# EasyEDA Pro project ProDoc_PCB1_2025-03-25.epro

# Board PCB1
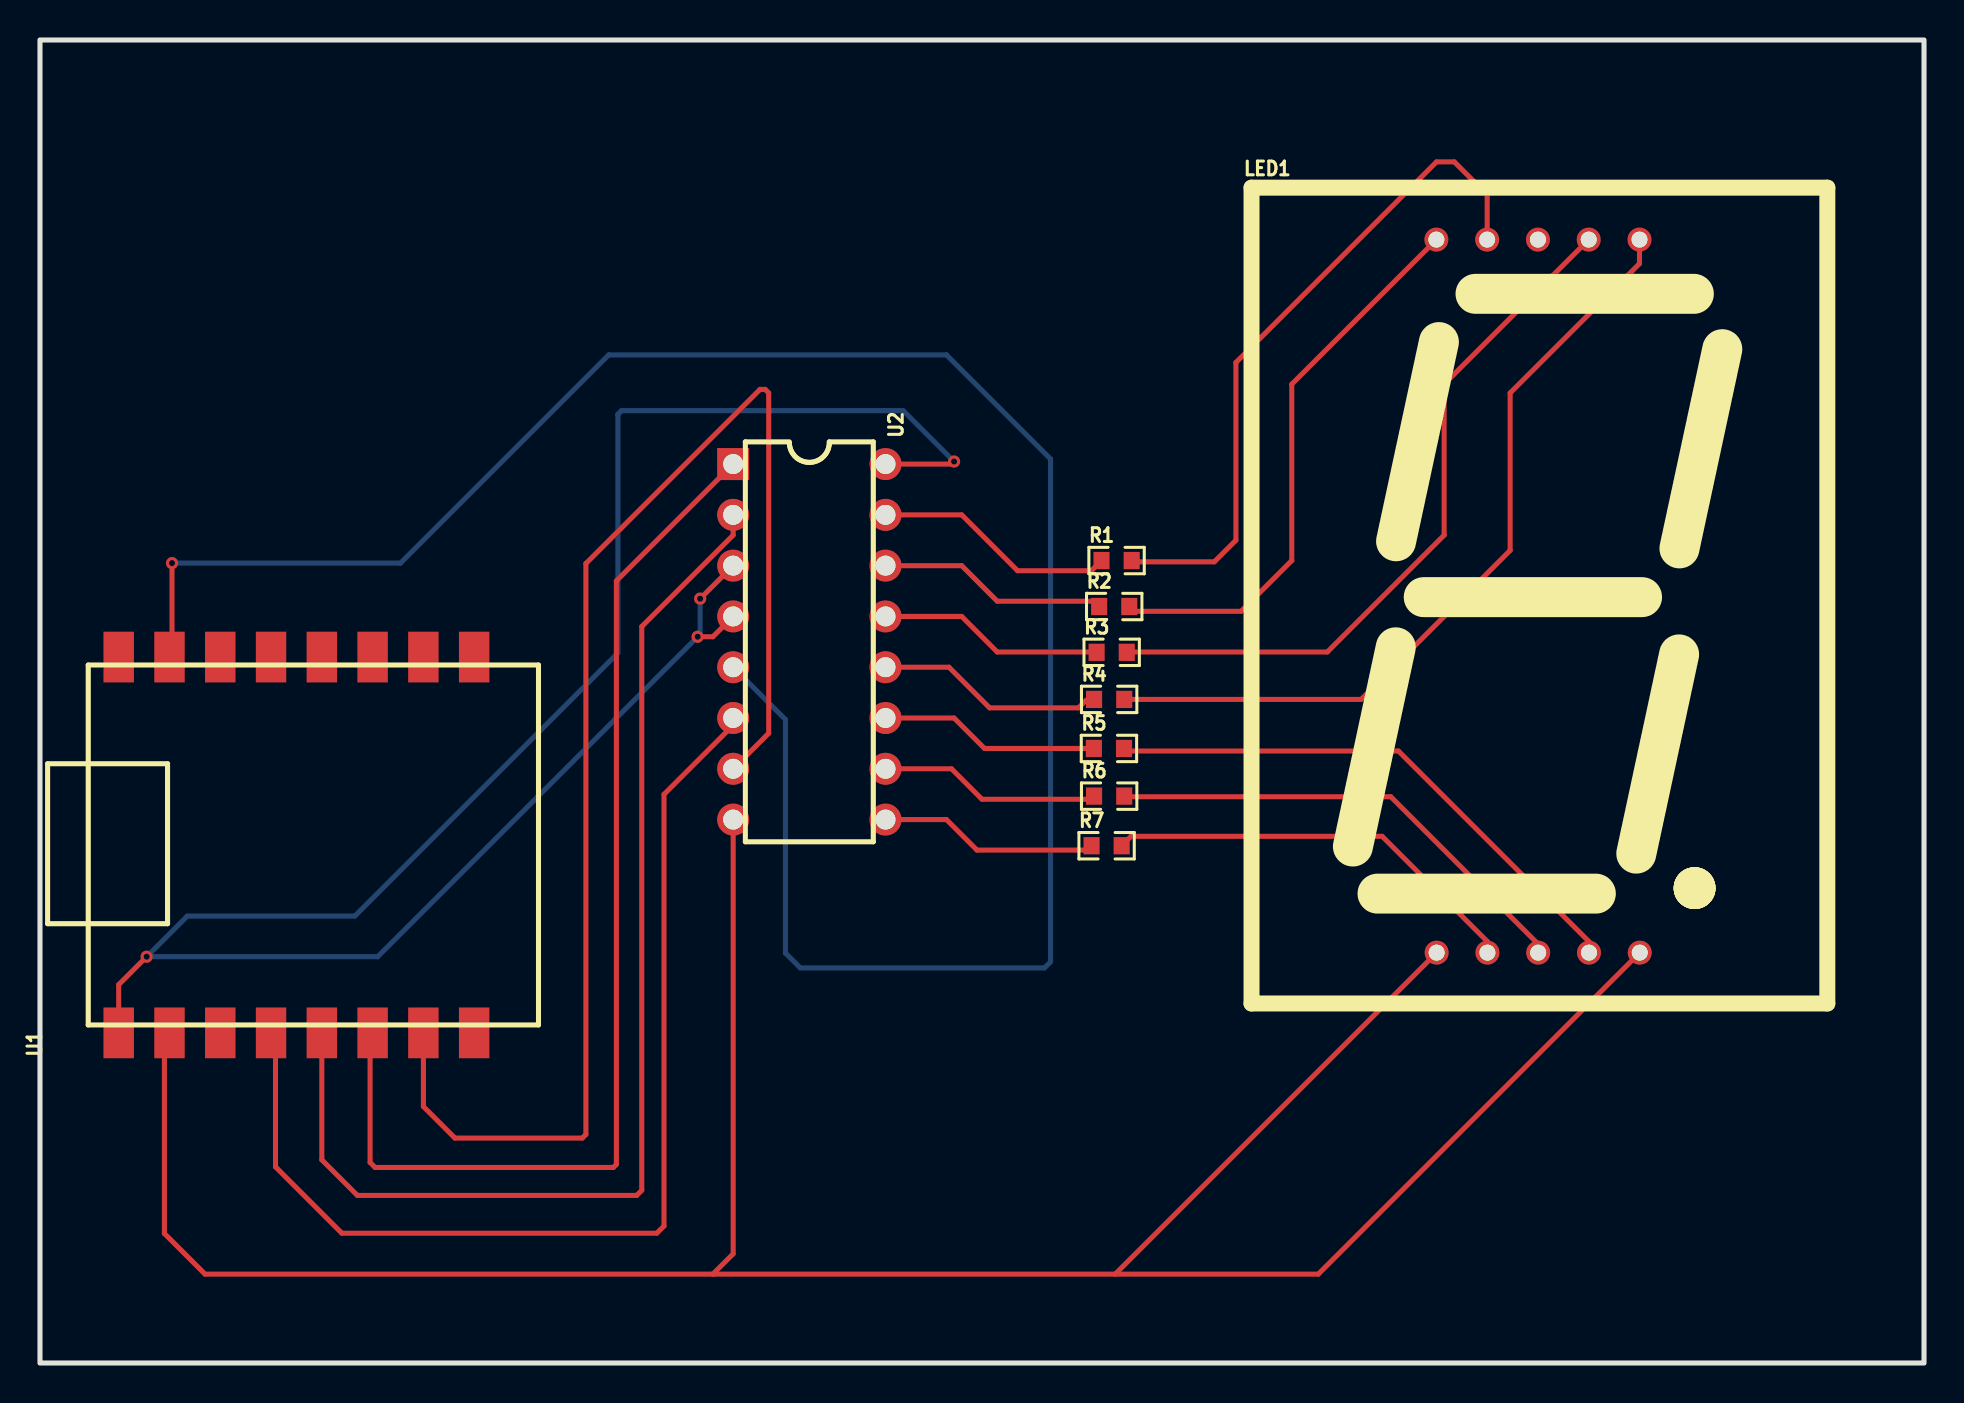
[diagram p0: board, top side]
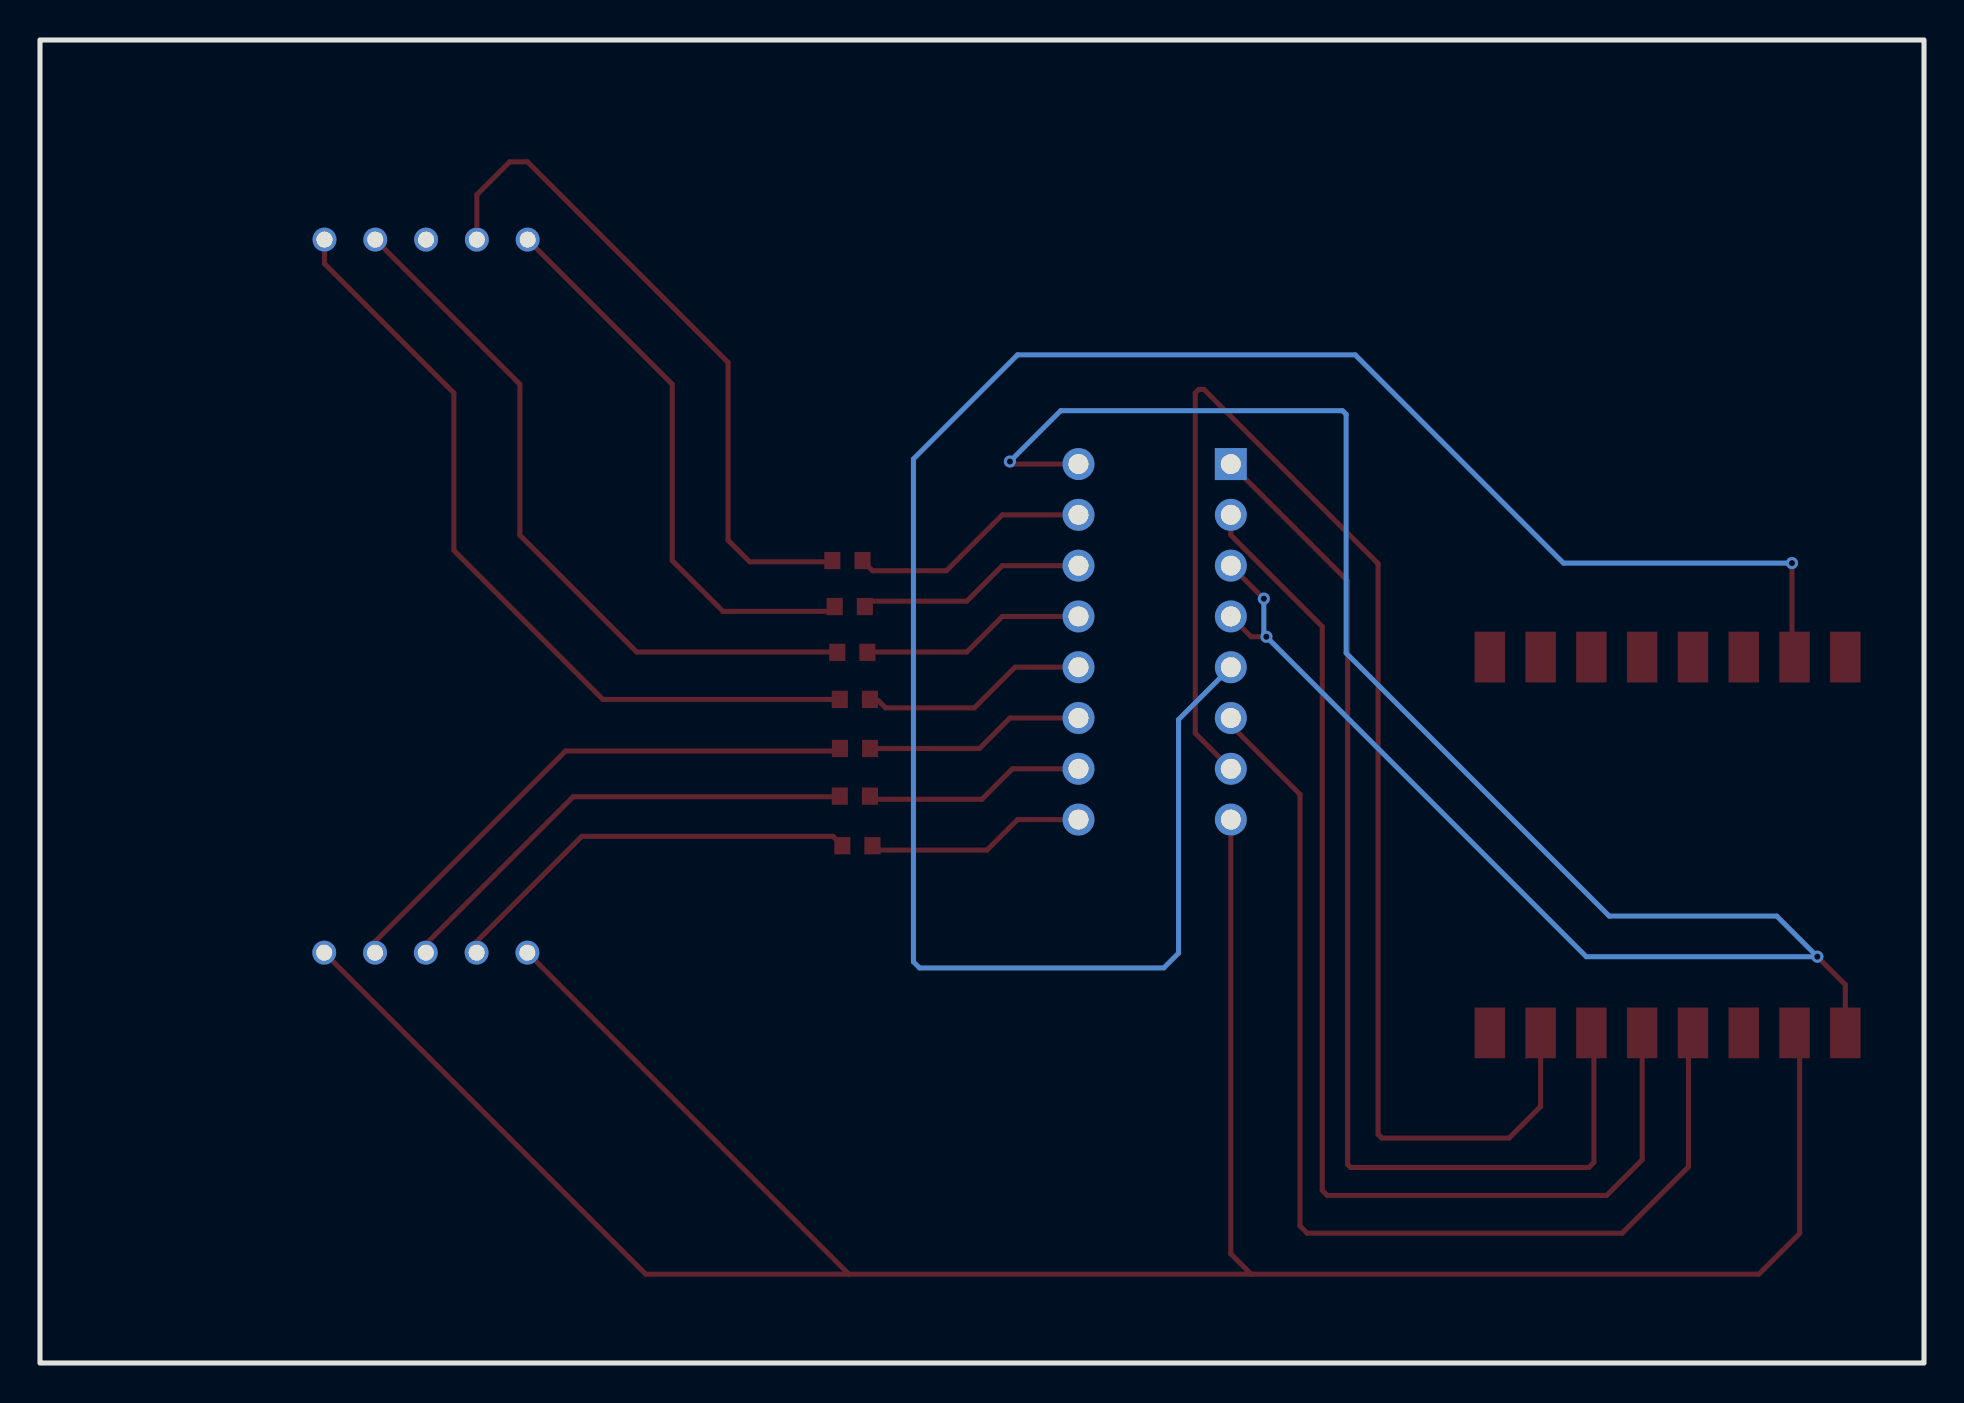
[diagram p1: board, bottom side, seen from below]

Outline 94.23 x 66.17 mm; copper layers: Top Layer, Bottom Layer. Coordinates in mm from the lower left corner of the outline.
Outline path: rectangle 0,66.17 94.23,0
Stack: Top Layer 0.035mm / Dielectric1 1.51mm FR4 er 4.5 / Bottom Layer 0.035mm

## Design rules (mm)
template: JLCPCB Capability(Two Layers Board)
spacing copperThickness1oz (default): track to track 0.102, other pairs 0.152 to 0.3
spacing copperThickness2oz: track to track 0.203, other pairs 0.152 to 0.3
track width copperThickness1oz (default): min 0.127, default 0.254, max 2.54
track width copperThickness2oz: min 0.203, default 0.254, max 2.54
differential pair differentialPair (default): width min 0.127, default 0.254, max 2.54; gap min 0.152, default 0.152
via viaSize (default): diameter min 0.5, default 0.61, max 10; hole min 0.3, default 0.305, max 6.3

## Placement (name value [footprint] x y rotation side)
LED1  FJ12101AH  [LED-SEG-TH_10P-L28.8-W40.8-P2.54-S35.56-BL]  74.93 38.35 0 top
R1  10K  [R0603]  53.85 40.13 0 top
R2  10K  [R0603]  53.73 37.83 0 top
R3  10K  [R0603]  53.6 35.54 0 top
R4  10K  [R0603]  53.48 33.19 0 top
R5  1K  [R0603]  53.47 30.73 0 top
R6  1K  [R0603]  53.48 28.35 0 top
R7  1K  [R0603]  53.35 25.87 0 top
U1  -  [ESP32-C3 Super Mini]  12.06 25.91 90 top
U2  CD4511BE  [DIP-16_L19.8-W6.5-P2.54-LS7.6-BL]  38.48 36.07 270 top

## Footprints (pads in the part's own frame, mm; a bottom-side part is the same pattern mirrored in y, then rotated)
DIP-16_L19.8-W6.5-P2.54-LS7.6-BL
  rect 1.6x1.6 hole 1: 1(-8.89,-3.81)
  round 1.6 hole 1: 2(-6.35,-3.81) 3(-3.81,-3.81) 4(-1.27,-3.81) 5(1.27,-3.81) 6(3.81,-3.81) 7(6.35,-3.81) 8(8.89,-3.81) 9(8.89,3.81) 10(6.35,3.81) 11(3.81,3.81) 12(1.27,3.81) 13(-1.27,3.81) 14(-3.81,3.81) 15(-6.35,3.81) 16(-8.89,3.81)
ESP32-C3 Super Mini
  rect 2.54x1.524 smd: 1(-9.398,8.128) 2(-9.398,5.588) 3(-9.398,3.048) 4(-9.398,0.508) 5(-9.398,-2.032) 6(-9.398,-4.572) 7(-9.398,-7.112) 8(-9.398,-9.652) 9(9.398,-9.652) 10(9.398,-7.112) 11(9.398,-4.572) 12(9.398,-2.032) 13(9.398,0.508) 14(9.398,3.048) 15(9.398,5.588) 16(9.398,8.128)
LED-SEG-TH_10P-L28.8-W40.8-P2.54-S35.56-BL
  round 1.2 hole 0.8: 1(-5.074,-17.831) 2(-2.534,-17.831) 3(0.006,-17.831) 4(2.546,-17.831) 5(5.087,-17.831) 6(5.074,17.83) 7(2.534,17.83) 8(-0.006,17.83) 9(-2.546,17.83) 10(-5.087,17.83)
R0603
  rect 0.806x0.864 smd: 1(-0.753,0) 2(0.753,0)

## Nets
+5V: U1.1 U2.3 U2.4 U2.16
GND: LED1.1 LED1.5 U1.2 U2.8
$1N587: R1.1 U2.15
$1N593: R2.1 U2.14
$1N600: R3.1 U2.13
$1N636: R4.1 U2.12
$1N645: R5.1 U2.11
$1N652: R6.1 U2.10
$1N662: R7.1 U2.9
$1N788: LED1.10 R2.2
$1N795: LED1.9 R1.2
$1N806: LED1.7 R3.2
$1N813: LED1.6 R4.2
$1N1052: LED1.2 R7.2
$1N1062: LED1.3 R6.2
$1N1069: LED1.4 R5.2
$1N1207: U1.7 U2.7
$1N1213: U1.6 U2.1
$1N1220: U1.5 U2.2
$1N1227: U1.4 U2.6
$1N1237: U1.15 U2.5

Pads without a net: LED1 8; U1 3 8 9 10 11 12 13 14 16

## Via types
v1: diameter 0.61, hole 0.305, Top Layer to Bottom Layer, 5 vias

## Routing (per net, layer and track width the routed paths; a pad name or vN(x,y) marks a point on that pad's centre or on a via; arc(x,y) is an arc through that point)
+5V: length 108.3
  Top Layer w0.254: U2.16 45.59,44.96 v1(45.72,45.09) ; v1(5.33,20.32) 3.94,18.92 U1.1 ; v1(32.89,36.32) 33.66,36.32 U2.4 ; v1(33.02,38.23) U2.3
  Bottom Layer w0.254: v1(45.72,45.09) 43.18,47.63 29.08,47.63 28.9,47.45 28.9,35.51 15.75,22.35 7.37,22.35 v1(5.33,20.32) 16.89,20.32 v1(32.89,36.32) 33.02,36.45 v1(33.02,38.23)
GND: length 137.3
  Top Layer w0.254: 53.78,4.45 33.66,4.45 ; 53.78,4.45 63.94,4.45 LED1.5 ; 53.78,4.45 LED1.1 ; 33.66,4.45 34.67,5.46 U2.8 ; 33.66,4.45 8.25,4.45 6.22,6.48 6.22,16.26 U1.2
$1N587: length 12.2
  Top Layer w0.254: U2.15 46.1,42.42 48.9,39.62 52.59,39.62 R1.1
$1N593: length 11.5
  Top Layer w0.254: U2.14 46.1,39.88 47.88,38.1 52.71,38.1 R2.1
$1N600: length 11.3
  Top Layer w0.254: R3.1 52.83,35.56 47.88,35.56 46.1,37.34 U2.13
$1N636: length 11
  Top Layer w0.254: U2.12 45.47,34.8 47.5,32.77 51.94,32.77 52.32,33.15
$1N645: length 11.1
  Top Layer w0.254: U2.11 45.72,32.26 47.24,30.73 R5.1
$1N652: length 11.1
  Top Layer w0.254: U2.10 45.59,29.72 47.12,28.19 52.56,28.19 R6.1
$1N662: length 11
  Top Layer w0.254: 52.6,25.87 52.38,25.65 46.86,25.65 45.34,27.18 U2.9
$1N788: length 28.3
  Top Layer w0.254: R2.2 54.72,37.59 60.07,37.59 62.61,40.13 62.61,48.95 LED1.10
$1N795: length 34.2
  Top Layer w0.254: LED1.9 72.38,58.43 70.74,60.07 69.85,60.07 59.82,50.04 59.82,41.15 58.74,40.07 54.66,40.07 R1.2
$1N806: length 36.1
  Top Layer w0.254: LED1.7 70.23,48.95 70.23,41.4 64.39,35.56 54.37,35.56 R3.2
$1N813: length 40.6
  Top Layer w0.254: R4.2 66.08,33.19 73.53,40.64 73.53,48.51 80,54.98 LED1.6
$1N1052: length 21.2
  Top Layer w0.254: LED1.2 72.4,21.08 67.13,26.34 54.57,26.34 R7.2
$1N1062: length 24.2
  Top Layer w0.254: LED1.3 74.94,20.95 67.56,28.32 54.26,28.32 R6.2
$1N1069: length 27.8
  Top Layer w0.254: LED1.4 77.48,21.08 67.94,30.61 54.35,30.61 R5.2
$1N1207: length 73.5
  Top Layer w0.254: U1.7 19.18,12.83 20.75,11.25 27.13,11.25 27.3,11.43 27.3,39.98 36.02,48.69 36.27,48.69 36.45,48.51 36.45,31.5 U2.7
$1N1213: length 56.5
  Top Layer w0.254: U2.1 28.83,39.12 28.83,9.93 28.68,9.78 16.76,9.78 16.51,10.03 16.51,16.38 U1.6
$1N1220: length 58.9
  Top Layer w0.254: U1.5 14.1,10.16 15.88,8.38 29.84,8.38 30.1,8.64 30.1,36.83 34.67,41.4 U2.2
$1N1227: length 54.6
  Top Layer w0.254: U2.6 34.64,32.23 34.64,31.87 31.21,28.44 31.21,6.85 30.85,6.49 15.1,6.49 11.78,9.81 11.78,15.87 11.53,16.12 11.53,16.48 U1.4
$1N1237: length 109.4
  Top Layer w0.254: U1.15 6.6,35.43 v1(6.6,40.01)
  Bottom Layer w0.254: U2.5 37.29,32.18 37.29,20.5 38.03,19.76 50.24,19.76 50.55,20.07 50.55,45.21 45.34,50.42 28.45,50.42 18.03,40.01 v1(6.6,40.01)
